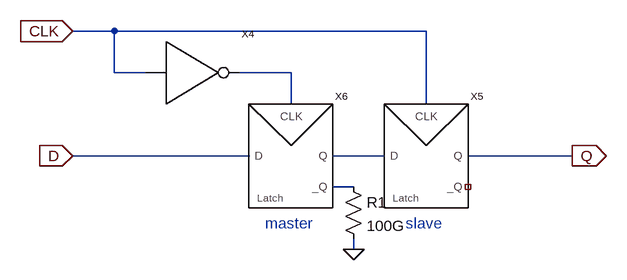
[diagram p0: schematic DFlipFlop.asc]
DFlipFlop.asc, the LTspice schematic file:
Version 4
SHEET 1 880 680
WIRE -176 96 -240 96
WIRE 304 96 -176 96
WIRE -176 160 -176 96
WIRE -128 160 -176 160
WIRE 96 160 16 160
WIRE 96 208 96 160
WIRE 304 208 304 96
WIRE 32 288 -240 288
WIRE 240 288 160 288
WIRE 528 288 368 288
WIRE 192 336 160 336
WIRE 192 432 192 416
FLAG -240 96 CLK
IOPIN -240 96 In
FLAG -240 288 D
IOPIN -240 288 In
FLAG 528 288 Q
IOPIN 528 288 Out
FLAG 192 432 0
SYMBOL inverter -96 160 R0
SYMATTR InstName X4
SYMBOL Dlatch 304 288 R0
SYMATTR InstName X5
SYMBOL Dlatch 96 288 R0
SYMATTR InstName X6
SYMBOL res 176 320 R0
SYMATTR InstName R1
SYMATTR Value 100G
TEXT 56 392 Left 2 ;master
TEXT 272 392 Left 2 ;slave

The netlist it stands for:
* DFlipFlop.asc
XX4 CLK N001 inverter  ; pins Vin Vout
XX5 CLK N002 NC_01 Q Dlatch  ; pins CLK D _Q Q
XX6 N001 D N003 N002 Dlatch  ; pins CLK D _Q Q
R1 N003 0 100G
* master
* slave
.backanno
.end